# Altium schematic sheet device-radiator-fan.SchDoc
size 297 x 209 mm
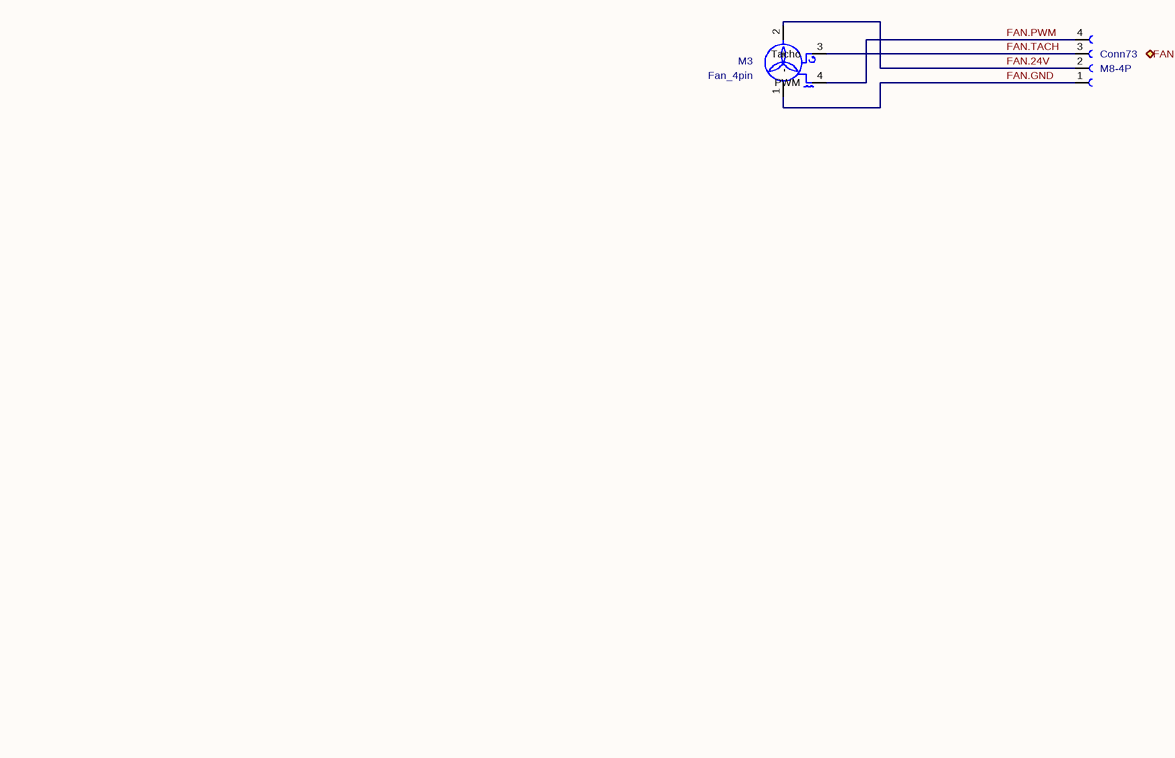
[diagram p0: device-radiator-fan.SchDoc]

## Parts
Conn73  P/N: M8-4P  (hidden comment: Deutsch_DTM_4S_Pin)
M3  Fan_4pin  [FanPinHeader_1x04_P2.54mm_Vertical]

## Ports
FAN (bidir)

## Nets
FAN.24V: Conn73.2 M3.2(+)
FAN.GND: Conn73.1 M3.1(-)
FAN.PWM: Conn73.4 M3.4(PWM)
FAN.TACH: Conn73.3 M3.3(Tacho)

## Notes on the sheet
- 1
- 2
- 3
- 4
- 5
- 6
- A
- B
- C
- D
- Title: DEVICE - RADIATOR FAN
- File: device-radiator-fan.kicad_sch
- Sheet: /
- KiCad E.D.A.  kicad (5.1.4)-1
- Size: A4
- Date:
- Rev:
- Id: 1/1

## Library data of the parts
M3 = Fan_4pin: Description: Fan, tacho output, PWM input, 4-pin connector; Value: Fan_4pin; Footprint: Connector:FanPinHeader_1x04_P2.54mm_Vertical
Conn73 = Deutsch_DTM_4S_Pin: Value: Deutsch_DTM_4S_Pin